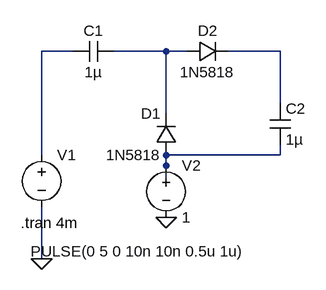
[diagram p0: schematic Dc Dc charge pump.asc]
Dc Dc charge pump.asc, the LTspice schematic file:
Version 4.1
SHEET 1 880 680
WIRE 48 48 0 48
WIRE 192 48 112 48
WIRE 224 48 192 48
WIRE 368 48 288 48
WIRE 368 128 368 48
WIRE 192 144 192 48
WIRE 0 208 0 48
WIRE 368 208 368 192
WIRE 368 208 192 208
WIRE 192 224 192 208
WIRE 192 256 192 224
WIRE 0 368 0 288
FLAG 192 304 0
FLAG 0 368 0
SYMBOL voltage 0 192 R0
WINDOW 3 -17 164 Left 2
WINDOW 123 0 0 Left 0
WINDOW 39 0 0 Left 0
SYMATTR Value PULSE(0 5 0 10n 10n 0.5u 1u)
SYMATTR InstName V1
SYMBOL cap 352 128 R0
SYMATTR InstName C2
SYMATTR Value 1µ
SYMBOL diode 208 208 R180
WINDOW 0 24 64 Left 2
WINDOW 3 24 0 Left 2
SYMATTR InstName D1
SYMATTR Value 1N5818
SYMBOL diode 224 64 R270
WINDOW 0 32 32 VTop 2
WINDOW 3 0 32 VBottom 2
SYMATTR InstName D2
SYMATTR Value 1N5818
SYMBOL cap 112 32 R90
WINDOW 0 0 32 VBottom 2
WINDOW 3 32 32 VTop 2
SYMATTR InstName C1
SYMATTR Value 1µ
SYMBOL voltage 192 208 R0
WINDOW 123 0 0 Left 0
WINDOW 39 0 0 Left 0
SYMATTR InstName V2
SYMATTR Value 1
TEXT -32 312 Left 2 !.tran 4m

The netlist it stands for:
* Dc Dc charge pump.asc
V1 N001 0 PULSE(0 5 0 10n 10n 0.5u 1u)
C2 N003 N004 1µ
D1 N004 N002 1N5818
D2 N002 N003 1N5818
C1 N002 N001 1µ
V2 N004 0 1
.model D D
.lib standard.dio
.tran 4m
.backanno
.end